# EAGLE design ACL Shield V3 (EAGLE 6.4)
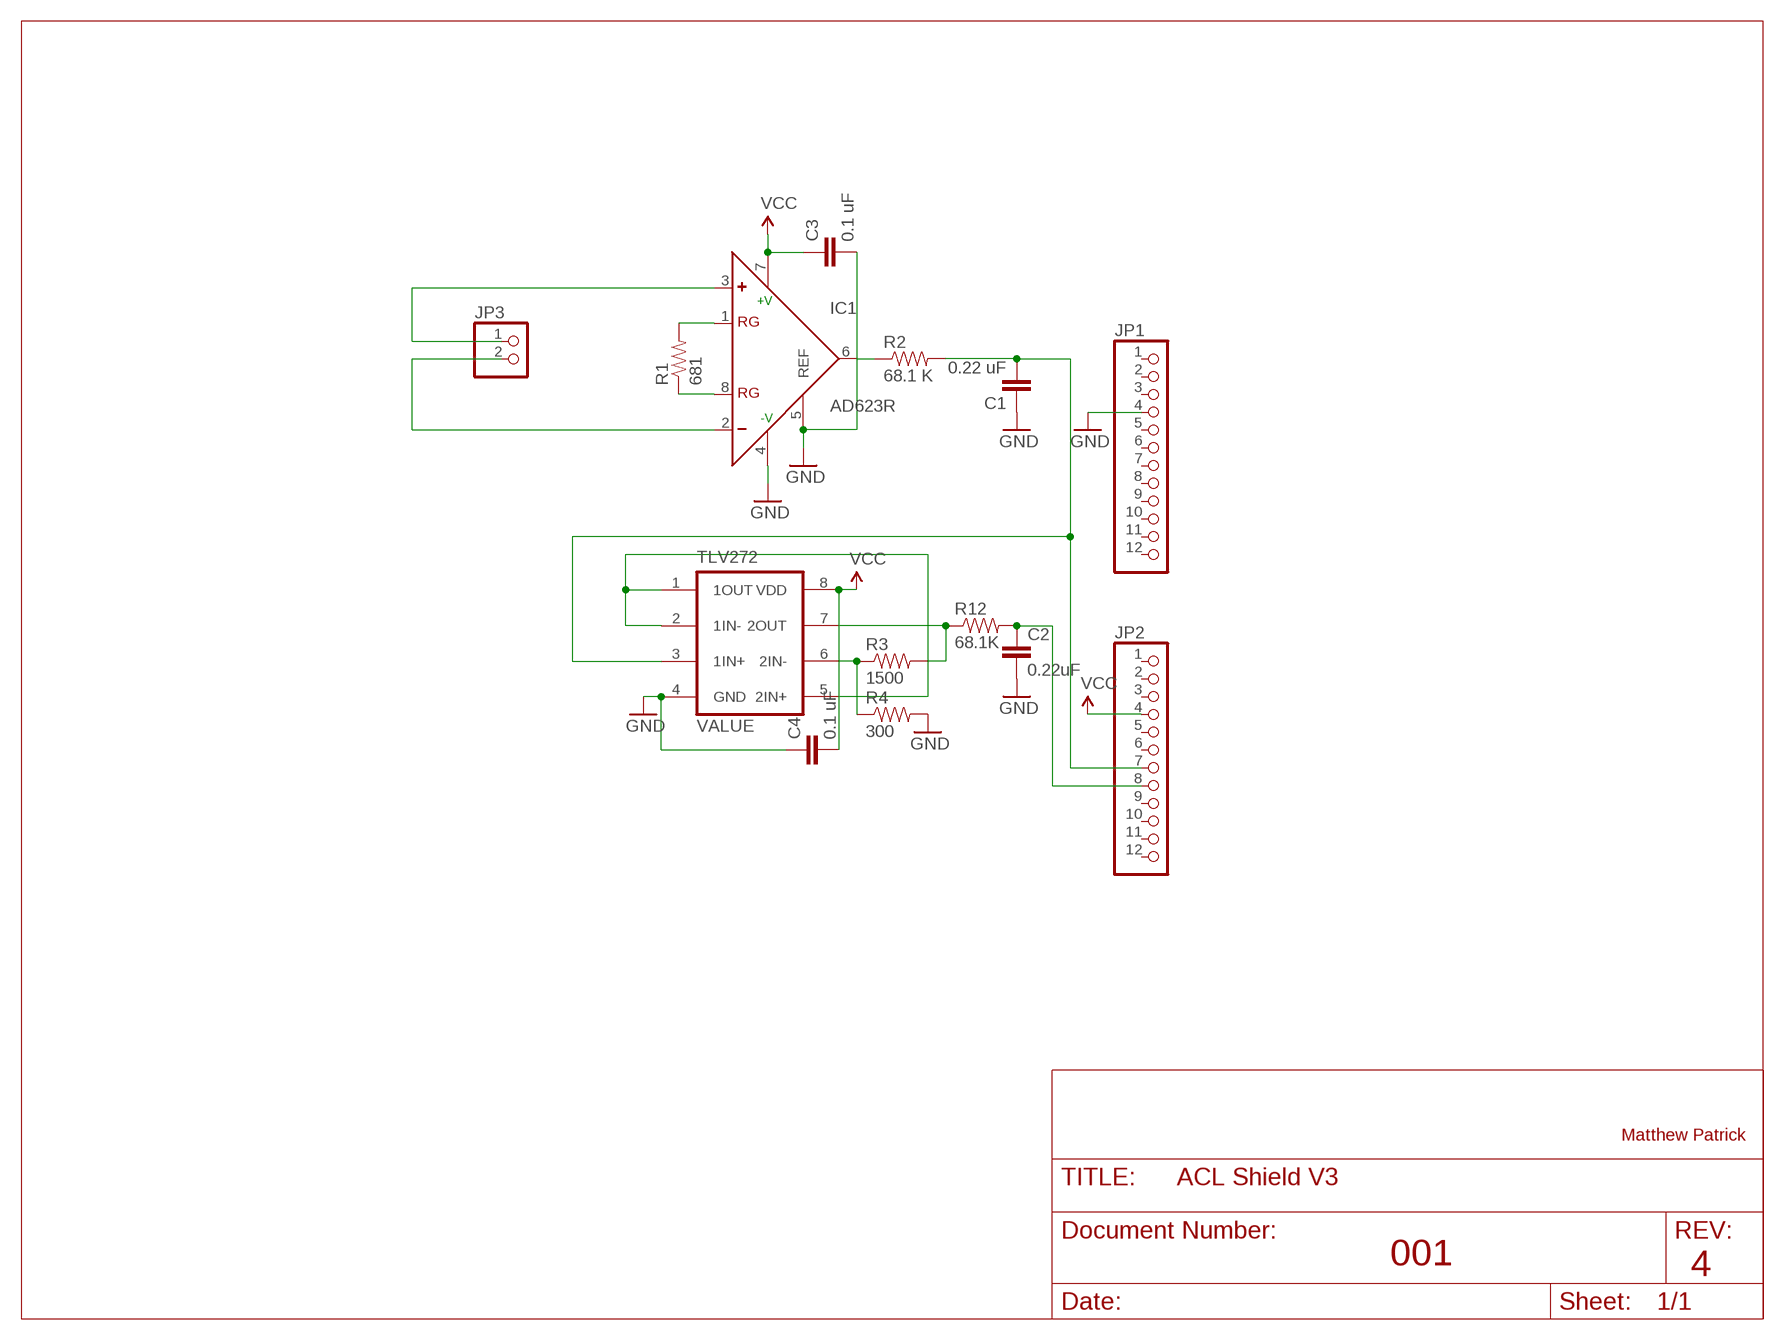
[diagram p0: schematic, sheet 1]

## Parts
C1  0.22 uF  CAP0603-CAP  [0603-CAP]
C2  0.22uF  CAP0603-CAP  [0603-CAP]
C3  0.1 uF  CAP0603-CAP  [0603-CAP]
C4  0.1 uF  CAP0603-CAP  [0603-CAP]
IC1  AD623R  [SO8]
JP1  PINHD-1X12  [1X12]
JP2  PINHD-1X12  [1X12]
JP3  PINHD-1X2  [1X02]
R1  681  RESISTOR0603-RES  [0603-RES]
R2  68.1 K  RESISTOR0603-RES  [0603-RES]
R3  1500  RESISTOR0603-RES  [0603-RES]
R4  300  RESISTOR0603-RES  [0603-RES]
R12  68.1K  RESISTOR0603-RES  [0603-RES]
U$2  T2721  [SO-08]

## Nets
GND: C1.1 C2.2 C3.2 C4.1 IC1.4(-V) IC1.5(REF) JP1.4 R4.2 U$2.4(GND)
N$1: IC1.1(RG) R1.2
N$2: IC1.8(RG) R1.1
N$3: C1.2 JP2.7 R2.2 U$2.3(1IN+)
N$4: IC1.6(OUT) R2.1
N$5: U$2.1(1OUT) U$2.2(1IN-) U$2.5(2IN+)
N$6: R3.1 R4.1 U$2.6(2IN-)
N$7: R3.2 R12.1 U$2.7(2OUT)
N$9: IC1.2(-) JP3.2
N$14: C2.1 JP2.8 R12.2
N$16: IC1.3(+) JP3.1
VCC: C3.1 C4.2 IC1.7(+V) JP2.4 U$2.8(VDD)
Unconnected: JP1.1 JP1.2 JP1.3 JP1.5 JP1.6 JP1.7 JP1.8 JP1.9 JP1.10 JP1.11 JP1.12 JP2.1 JP2.2 JP2.3 JP2.5 JP2.6 JP2.9 JP2.10 JP2.11 JP2.12

## Notes on the sheet
- Matthew Patrick
- 001
- 4

## Library data of the parts
C1-C4 = SparkFun:CAP: Capacitor Standard 0603 ceramic capacitor, and 0.1" leaded capacitor.
IC1 = analog-devices:AD623: Single-Supply, Rail-to-Rail, Low Cost Instrumentation Amplifier Source: http://www.analog.com/static/imported-files/data_sheets/AD623.pdf; MPN: AD623ARZ.; OC_FARNELL: 9426213; OC_NEWARK: 31M4186
JP1 JP2 = pinhead:PINHD-1X12: PIN HEADER
JP3 = pinhead:PINHD-1X2: PIN HEADER
R1-R4 R12 = SparkFun:RESISTOR: Resistor Basic schematic elements and footprints for 0603, 1206, and PTH resistors.
U$2 = ACL-Parts:T2721

## Board
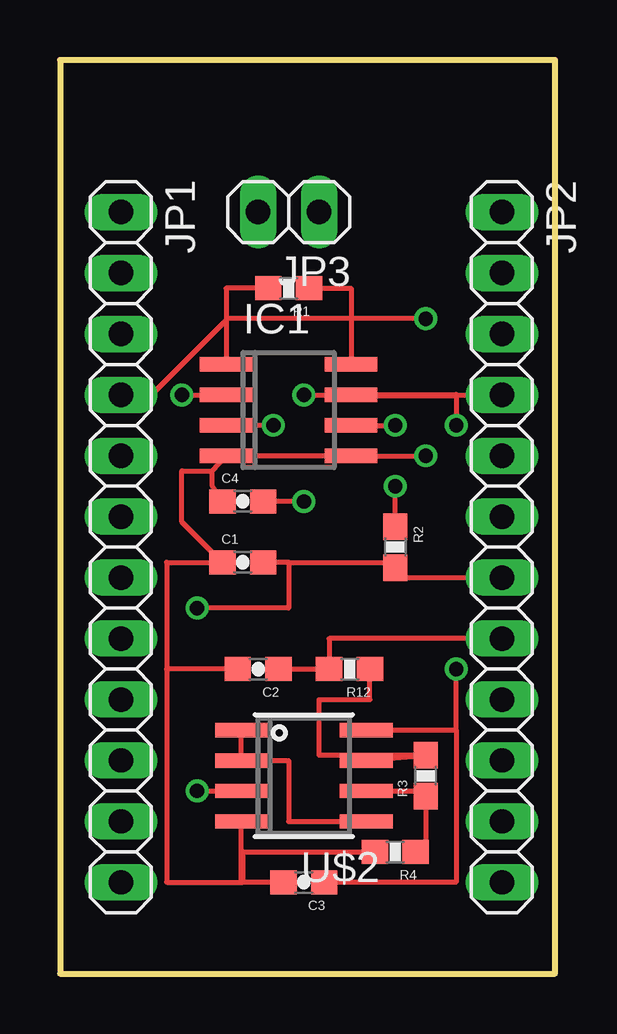
[diagram p1: board, top side]
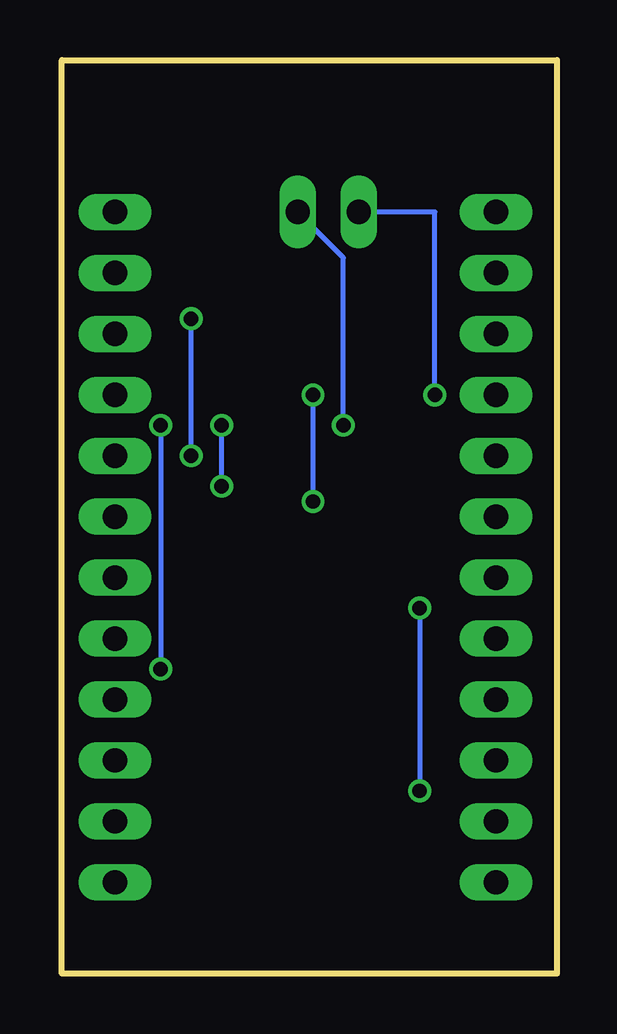
[diagram p2: board, bottom side, seen from below]

Size 20.62 x 38.09 mm. Coordinates in mm from the lower left corner, seen from the top.
Outline: 0,0 20.62,0 20.62,38.09 0,38.09 0,0
Copper layers (1*16): Top 0.0356mm / dielectric 1.5011mm / Bottom 0.0356mm
Design rules "LaenPCBOrder": minimum track width 6mil, minimum drill 13mil, track to track 6mil, track to pad 6mil, pad to pad 6mil, via to via 6mil, smd to smd 6mil, copper to edge 15mil, drill to drill 6mil, minimum pad ring 7mil, minimum via ring 7mil, stop-mask expansion 3mil, vias tented up to drill 0mil, thermal gap 10mil

### Footprints (pad centres in the part's own frame; a part is rotated, then mirrored left to right if it is on the bottom)
0603-CAP = smd 1.1 x 1: 1 -0.85,0; 2 0.85,0
SO8 = smd 0.6 x 2.2: 1 -1.905,-2.6; 2 -0.635,-2.6; 3 0.635,-2.6; 4 1.905,-2.6; 5 1.905,2.6; 6 0.635,2.6; 7 -0.635,2.6; 8 -1.905,2.6
1X12 = drill 1.016 long: 1 -13.97,0; 2 -11.43,0; 3 -8.89,0; 4 -6.35,0; 5 -3.81,0; 6 -1.27,0; 7 1.27,0; 8 3.81,0; 9 6.35,0; 10 8.89,0; 11 11.43,0; 12 13.97,0
1X02 = drill 1.016 long: 1 -1.27,0; 2 1.27,0
0603-RES = smd 1.1 x 1: 1 -0.85,0; 2 0.85,0
SO-08 = smd 2.2 x 0.6: 1 -3.87,6.985; 2 -3.87,5.715; 3 -3.87,4.445; 4 -3.87,3.175; 5 1.33,3.175; 6 1.33,4.445; 7 1.33,5.715; 8 1.33,6.985

### Placement (x,y rotation side)
C1  7.62,17.14 0 top
C2  8.26,12.7 180 top
C3  10.16,3.81 180 top
C4  7.62,19.68 0 top
IC1  9.53,23.5 270 top
JP1  2.54,17.78 270 top
JP2  18.41,17.78 270 top
JP3  9.53,31.75 180 top
R1  9.53,28.57 180 top
R2  13.97,17.78 270 top
R3  15.24,8.26 90 top
R4  13.97,5.08 180 top
R12  12.06,12.7 180 top
U$2  11.43,3.17 0 top

### Tracks (layer width: path | path; a pad name or v marks a point on that pad's centre or on a via)
GND  (via drill 0.6)
  Top 0.203: 4.45,12.7 4.45,17.14 C1.1 5.08,18.84 5.08,20.95 6.35,20.95 | C2.2 4.45,12.7 | 4.45,12.7 4.45,3.81 7.62,3.81 | v15.24,21.59 IC1.5 IC1.4 6.35,20.95 | 7.62,3.81 7.56,3.87 U$2.4 | C3.2 7.62,3.81 | 7.62,3.81 7.62,5.08 R4.2 | C4.1 6.35,20.32 6.35,20.95 | v15.24,27.3 6.99,27.3 3.81,24.13 JP1.4
  Bottom 0.203: v15.24,21.59 v15.24,27.3
N$1
  Top 0.203: R1.2 6.92,28.57 IC1.1
N$2
  Top 0.203: R1.1 12.12,28.57 IC1.8
N$3  (via drill 0.6)
  Top 0.203: 9.53,17.14 9.53,15.24 v5.71,15.24 | v5.71,7.62 U$2.3 | 9.53,17.14 C1.2 | JP2.7 13.97,16.51 R2.2 13.97,17.14 9.53,17.14
  Bottom 0.203: v5.71,15.24 v5.71,7.62
N$4  (via drill 0.6)
  Top 0.203: R2.1 v13.97,20.32 | IC1.6 v13.97,22.86
  Bottom 0.203: v13.97,20.32 v13.97,22.86
N$5
  Top 0.203: U$2.1 U$2.2 9.53,8.89 9.53,6.35 U$2.5
N$6
  Top 0.203: U$2.6 15.24,7.62 R3.1 15.24,5.08 R4.1
N$7
  Top 0.203: U$2.7 12.7,8.89 R3.2 10.79,9.11 10.79,11.43 12.91,11.43 R12.1
N$9  (via drill 0.6)
  Top 0.203: v5.08,24.13 IC1.2
  Bottom 0.203: v5.08,24.13 5.08,31.75 JP3.2
N$14
  Top 0.203: C2.1 R12.2 11.21,13.97 JP2.8
N$16  (via drill 0.6)
  Top 0.203: v8.89,22.86 IC1.3
  Bottom 0.203: v8.89,22.86 8.89,29.84 JP3.1
VCC  (via drill 0.6)
  Top 0.203: JP2.4 16.51,24.13 v16.51,22.86 | 16.51,10.16 v16.51,12.7 | U$2.8 16.51,10.16 | v10.16,24.13 IC1.7 | v10.16,19.68 C4.2 | 16.51,10.16 16.51,3.81 C3.1
  Top 0.254: IC1.7 16.51,24.13
  Bottom 0.203: v16.51,22.86 v16.51,12.7 | v10.16,24.13 v10.16,19.68